# EAGLE schematic SPI (EAGLE 6.6.0)
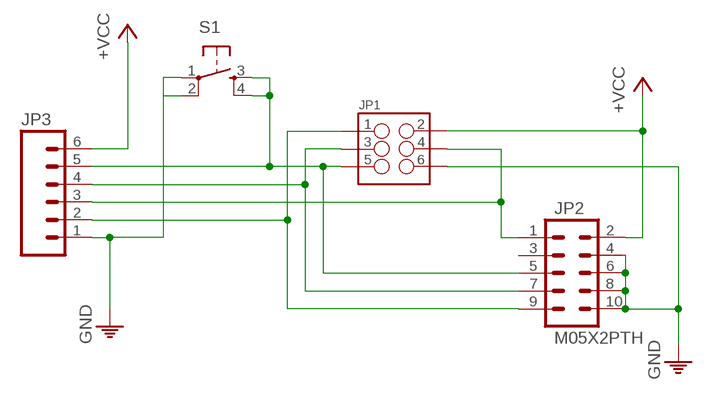
[diagram p0: schematic, sheet 1]

## Parts
JP1  M03X2NO_SILK  [2X3-NS]
JP2  M05X2PTH  [AVR_ICSP]
JP3  M06SIP  [1X06]
S1  TAC_SWITCHPTH  [TACTILE-PTH]

## Nets
+5V: JP1.2 JP2.2 JP3.6 ; supply symbol labelled +VCC
N$2: JP1.4 JP2.1 JP3.3
N$4: JP1.5 JP2.5 JP3.5 S1.3 S1.4
N$5: JP1.3 JP2.7 JP3.4
N$6: JP1.1 JP2.9 JP3.2
PE: JP1.6 JP2.4 JP2.6 JP2.8 JP2.10 JP3.1 S1.1 S1.2 ; supply symbol labelled GND
Unconnected: JP2.3

## Library data of the parts
JP1 = SparkFun-Connectors:M03X2: 2x3 .1" header. Shrouded, with keying- CONN-10681 SMT- CONN-11415 Pogo pins- HW-11044
JP2 = SparkFun-Connectors:M05X2: Header 5x2 Standard 10-pin dual row 0.1" header. Commonly used with AVR-ISP. Use with Spark Fun Electronics SKU: PRT-00778
JP3 = SparkFun-Connectors:M06: Header 6 Standard 6-pin 0.1" header. Use with straight break away headers (SKU : PRT-00116), right angle break away headers (PRT-00553), swiss pins (PRT-00743), machine pins (PRT-00117), and female headers (PRT-00115). Molex polarized connector foot print use with SKU : PRT-08094 with associated crimp pins and housings. NOTES ON THE VARIANTS LOCK and LOCK_LONGPADS... This footprint was designed to help hold the alignment of a through-hole component (i.e. 6-pin header) while soldering it into place. You may notice that each hole has been shifted either up or down by 0.005 of an inch from it's more standard position (which is a perfectly straight line). This slight alteration caused the pins (the squares in the middle) to touch the edges of the holes. Because they are alternating, it causes a "brace" to hold the component in place. 0.005 has proven to be the perfect amount of "off-center" position when using our standard breakaway headers. Although looks a little odd when you look at the bare footprint, once you have a header in there, the alteration is very hard to notice. Also,if you push a header all the way into place, it is covered up entirely on the bottom side. This idea of altering the position of holes to aid alignment will be further integrated into the Sparkfun Library for other footprints. It can help hold any component with 3 or more connection pins.
S1 = SparkFun-Electromechanical:TAC_SWITCH: Momentary Switch Button commonly used for reset or general input. Spark Fun Electronics SKU : COM-00097 SMT- SWCH-08247